# Altium schematic sheet DCF-Interface-1.SchDoc
size A4
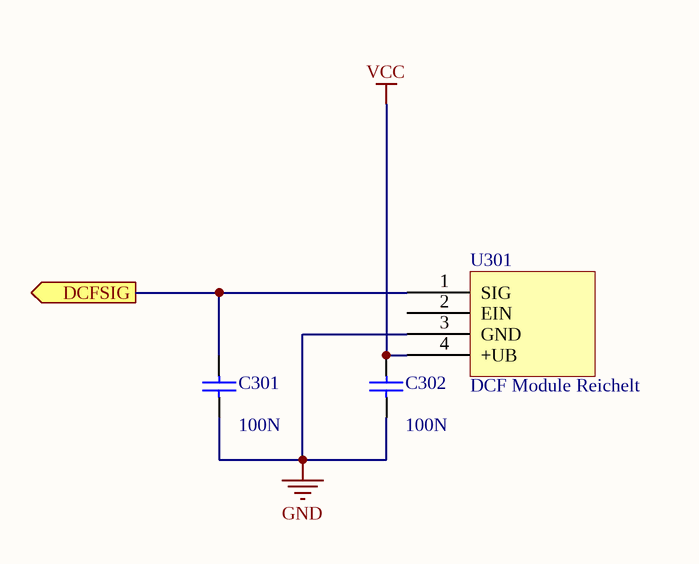
[diagram p0: DCF-Interface-1.SchDoc]

## Parts
C301  value 100N  [RCL 0805]  (hidden comment: Cap)
C302  value 100N  [RCL 0805]  (hidden comment: Cap)
U301  DCF Module Reichelt  [DCF MODUL REICHELT]

## Ports
DCFSIG (out)

## Nets
GND: C301.1 C302.1 U301.3(GND)
VCC: C302.2 U301.4(+UB)
DCFSIG: C301.2 U301.1(SIG) ; port DCFSIG

Not connected (* = marked no-connect by the designer): U301 2(EIN)

## Library data of the parts
C301 C302 = Cap: Capacitor; Published: 8-Jun-2000; LatestRevisionDate: 17-Jul-2002; LatestRevisionNote: Re-released for DXP Platform.; PackageReference: RAD-0.3; Publisher: Altium Limited